# EAGLE schematic brightness-control (EAGLE 6.6.0)
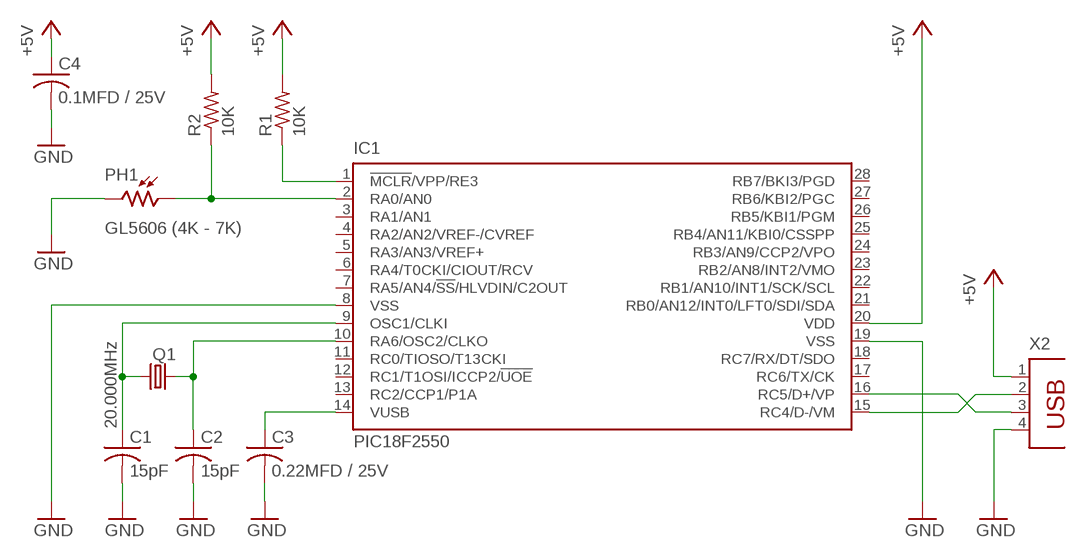
[diagram p0: schematic, sheet 1]

## Parts
C1  15pF  C-US050-024X044  [C050-024X044]
C2  15pF  C-US050-024X044  [C050-024X044]
C3  0.22MFD / 25V  C-US050-055X075  [C050-055X075]
C4  0.1MFD / 25V  C-US050-045X075  [C050-045X075]
IC1  PIC18F2550  PIC18F2550_28DIP  [DIL28-3]
PH1  GL5606 (4K - 7K)  V1060_21  [TO-5_V10]
Q1  20.000MHz  CRYSTALHC49U-LM  [HC49U-LM]
R1  10K  R-US_0207/10  [0207/10]
R2  10K  R-US_0207/10  [0207/10]
X2  PN61729  [PN61729]

## Nets
+5V: C4.1 IC1.20(VDD) R1.2 R2.2 X2.1
GND: C1.2 C2.2 C3.2 C4.2 IC1.8(VSS) IC1.19(VSS) PH1.2 X2.4
N$1: IC1.1(!MCLR!/VPP/RE3) R1.1
N$2: IC1.2(RA0/AN0) PH1.1 R2.1
N$3: C1.1 IC1.9(OSC1/CLKI) Q1.2
N$4: C2.1 IC1.10(RA6/OSC2/CLKO) Q1.1
N$5: C3.1 IC1.14(VUSB)
N$6: IC1.15(RC4/D-/VM) X2.2
N$7: IC1.16(RC5/D+/VP) X2.3
Unconnected: IC1.3(RA1/AN1) IC1.4(RA2/AN2/VREF-/CVREF) IC1.5(RA3/AN3/VREF+) IC1.6(RA4/T0CKI/CIOUT/RCV) IC1.7(RA5/AN4/!SS!/HLVDIN/C2OUT) IC1.11(RC0/TIOSO/T13CKI) IC1.12(RC1/T1OSI/ICCP2/!UOE) IC1.13(RC2/CCP1/P1A) IC1.17(RC6/TX/CK) IC1.18(RC7/RX/DT/SDO) IC1.21(RB0/AN12/INT0/LFT0/SDI/SDA) IC1.22(RB1/AN10/INT1/SCK/SCL) IC1.23(RB2/AN8/INT2/VMO) IC1.24(RB3/AN9/CCP2/VPO) IC1.25(RB4/AN11/KBI0/CSSPP) IC1.26(RB5/KBI1/PGM) IC1.27(RB6/KBI2/PGC) IC1.28(RB7/BKI3/PGD)

## Library data of the parts
C1-C4 = rcl:C-US: CAPACITOR, American symbol
IC1 = microchip:PIC18F2*_28: USB Microcontrollers with nanoWatt Technology High-Performance, Enhanced Flash, 28/40/44-Pin, Source: http://ww1.microchip.com/downloads/en/devicedoc/39632c.pdf; MF: MICROCHIP; MPN: PIC18F2550-I/SP; OC_FARNELL: 1523822; OC_NEWARK: 80K6054
PH1 = photo-elements:?1060*: Sensor Street Light control Source: http://optoelectronics.perkinelmer.com/content/Datasheets/DTS_PhotocellsB1060.pdf
Q1 = crystal:CRYSTAL: CRYSTAL; OC_FARNELL: 1666956; OC_NEWARK: unknown
R1 R2 = rcl:R-US_: RESISTOR, American symbol
X2 = con-berg:PN61729: BERG USB connector; OC_FARNELL: unknown; OC_NEWARK: unknown